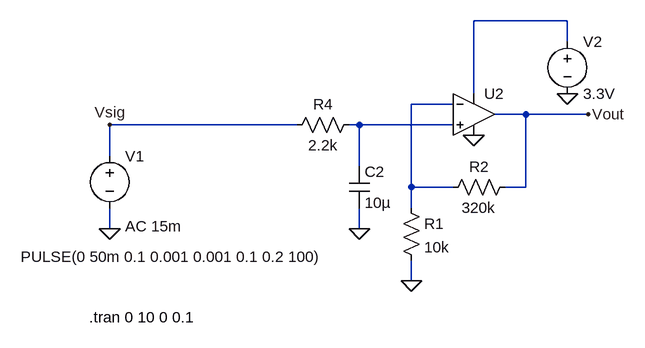
[diagram p0: schematic First order active filter amplifyer.asc]
First order active filter amplifyer.asc, the LTspice schematic file:
Version 4.1
SHEET 1 880 680
WIRE 304 16 160 16
WIRE 304 48 304 16
WIRE 160 128 160 16
WIRE 128 144 64 144
WIRE 240 160 192 160
WIRE 336 160 240 160
WIRE -112 176 -400 176
WIRE -16 176 -32 176
WIRE 128 176 -16 176
WIRE -400 224 -400 176
WIRE -16 240 -16 176
WIRE 64 272 64 144
WIRE 128 272 64 272
WIRE 240 272 240 160
WIRE 240 272 208 272
WIRE 64 304 64 272
WIRE -400 336 -400 304
WIRE -16 336 -16 304
WIRE 64 416 64 384
FLAG 64 416 0
FLAG -400 336 0
FLAG 304 128 0
FLAG 160 192 0
FLAG -400 176 Vsig
FLAG 336 160 Vout
FLAG -16 336 0
SYMBOL res -16 160 R90
WINDOW 0 0 56 VBottom 2
WINDOW 3 32 56 VTop 2
SYMATTR InstName R4
SYMATTR Value 2.2k
SYMBOL res 48 288 R0
SYMATTR InstName R1
SYMATTR Value 10k
SYMBOL res 224 256 R90
WINDOW 0 0 56 VBottom 2
WINDOW 3 32 56 VTop 2
SYMATTR InstName R2
SYMATTR Value 320k
SYMBOL cap -32 240 R0
SYMATTR InstName C2
SYMATTR Value 10µ
SYMBOL voltage -400 208 R0
WINDOW 3 -137 171 Left 2
WINDOW 123 24 124 Left 2
WINDOW 39 0 0 Left 0
SYMATTR InstName V1
SYMATTR Value PULSE(0 50m 0.1 0.001 0.001 0.1 0.2 100)
SYMATTR Value2 AC 15m
SYMBOL voltage 304 32 R0
WINDOW 123 0 0 Left 0
WINDOW 39 0 0 Left 0
SYMATTR InstName V2
SYMATTR Value 3.3V
SYMBOL OpAmps\\UniversalOpAmp2 160 160 R0
SYMATTR InstName U2
TEXT -432 472 Left 2 !.tran 0 10 0 0.1

The netlist it stands for:
* First order active filter amplifyer.asc
R4 N003 Vsig 2.2k
R1 N002 0 10k
R2 Vout N002 320k
C2 N003 0 10µ
V1 Vsig 0 PULSE(0 50m 0.1 0.001 0.001 0.1 0.2 100) AC 15m
V2 N001 0 3.3V
X§U2 N003 N002 N001 0 Vout level2 Avol=1Meg GBW=10Meg Slew=10Meg Ilimit=25m Rail=0 Vos=0 En=0 Enk=0 In=0 Ink=0 Rin=500Meg  ; pins In+ In- V+ V- OUT
.tran 0 10 0 0.1
.lib UniversalOpAmp2.lib
.backanno
.end